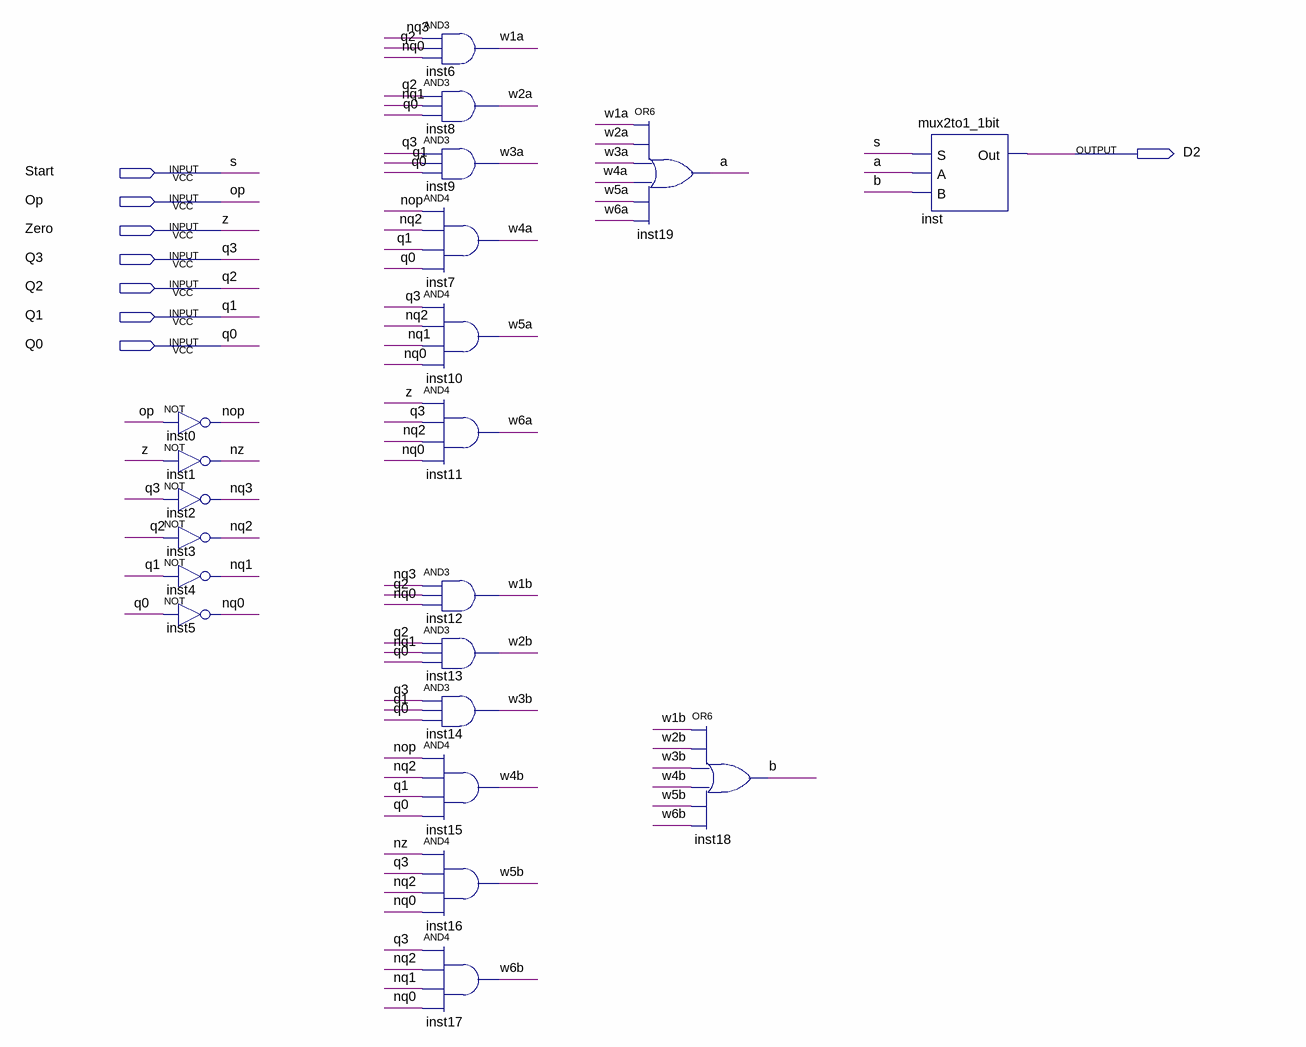
[diagram p0: schematic sheet]
// Quartus schematic D2.bdf as structural Verilog: 21 symbols, 8 pins
module D2 (
  input  Start,
  input  Op,
  input  Zero,
  input  Q3,
  input  Q2,
  input  Q1,
  input  Q0,
  output D2
);

  wire a, b, nop, nq0, nq1, nq2, nq3, nz, w1a, w1b, w2a, w2b, w3a, w3b, w4a, w4b, w5a, w5b, w6a, w6b;

  not inst0 (nop, Op);
  not inst1 (nz, Zero);
  not inst2 (nq3, Q3);
  not inst3 (nq2, Q2);
  not inst4 (nq1, Q1);
  not inst5 (nq0, Q0);
  and inst6 (w1a, nq3, Q2, nq0);
  and inst8 (w2a, Q2, nq1, Q0);
  and inst9 (w3a, Q3, Q1, Q0);
  and inst7 (w4a, nop, nq2, Q1, Q0);
  and inst10 (w5a, Q3, nq2, nq1, nq0);
  and inst11 (w6a, Zero, Q3, nq2, nq0);
  and inst12 (w1b, nq3, Q2, nq0);
  and inst13 (w2b, Q2, nq1, Q0);
  and inst14 (w3b, Q3, Q1, Q0);
  and inst15 (w4b, nop, nq2, Q1, Q0);
  and inst16 (w5b, nz, Q3, nq2, nq0);
  and inst17 (w6b, Q3, nq2, nq1, nq0);
  or inst19 (a, w1a, w2a, w3a, w4a, w5a, w6a);
  or inst18 (b, w1b, w2b, w3b, w4b, w5b, w6b);
  mux2to1_1bit inst (.S(Start), .A(a), .B(b), .Out(D2));

  // Other names for the same wires on the sheet: s = Start; z = Zero
endmodule
